# Altium schematic sheet Data_Transmission_Panel.SchDoc
size A3
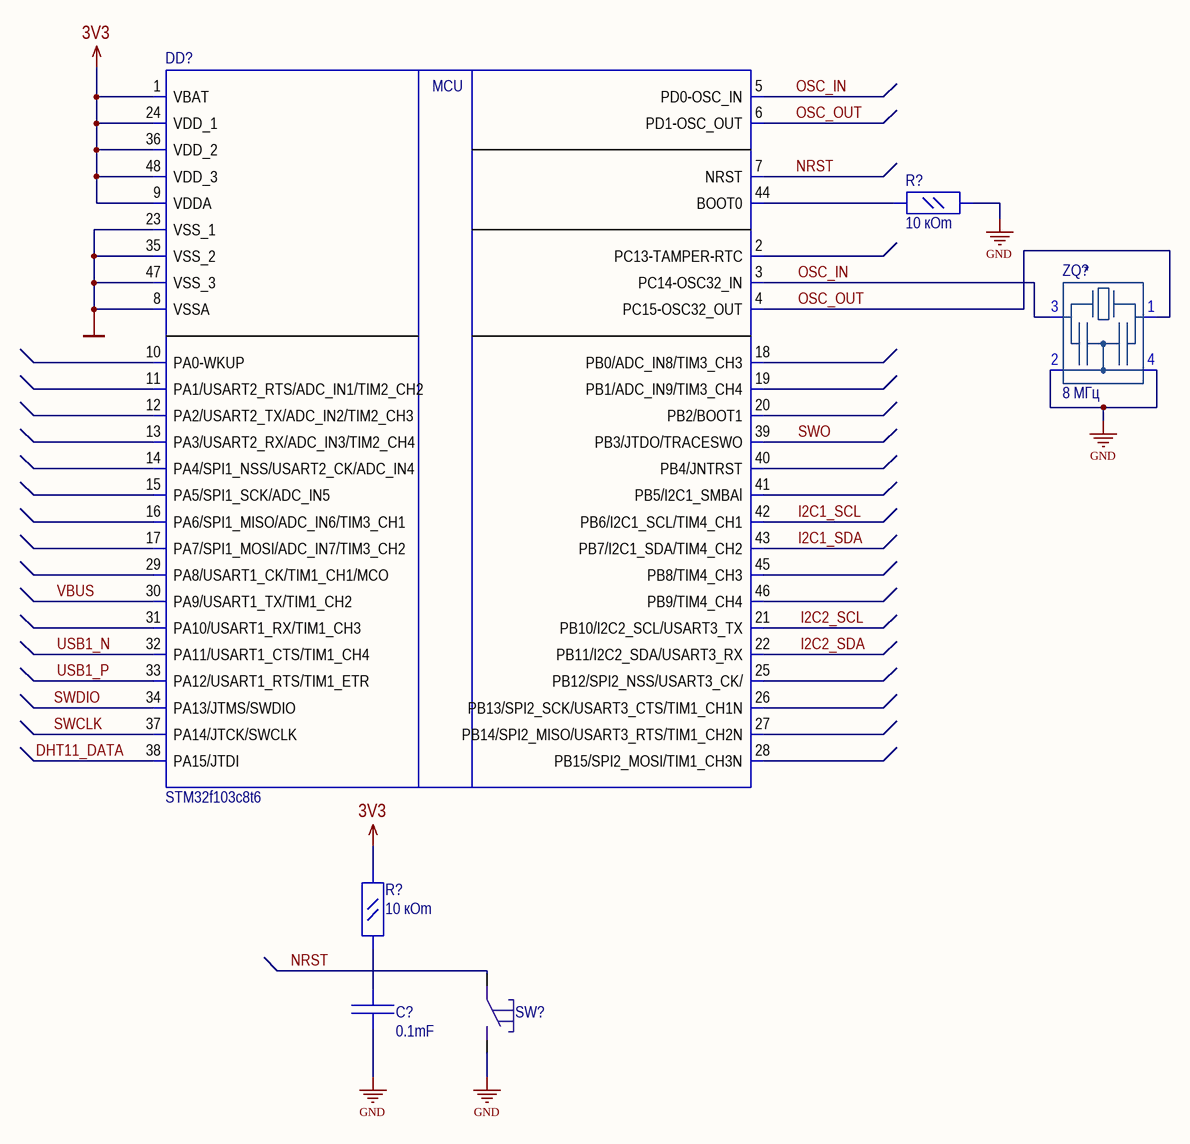
[diagram p0: Data_Transmission_Panel.SchDoc]

## Parts
(Parts that share a designator on the sheet are numbered #1, #2 ... from top to bottom, then left to right.)
C?  0.1mF  [C_0805]
DD?  STM32f103c8t6  [LQFP48]
R?#1  10 кOm  [R_0805]
R?#2  10 кOm  [R_0805]
SW?  KLS7-TS6604  [KLS7-TS6604-5.0-180-B]  (value not drawn)
ZQ?  8 МГц  [MJ CRYSTAL]

## Nets
3V3: DD?.1(VBAT) DD?.9(VDDA) DD?.24(VDD_1) DD?.36(VDD_2) DD?.48(VDD_3) R?#2.2
GND: C?.1 DD?.8(VSSA) DD?.23(VSS_1) DD?.35(VSS_2) DD?.47(VSS_3) R?#1.1 SW?.1 ZQ?.2 ZQ?.4
DHT11_DATA: DD?.38(PA15/JTDI)
I2C1_SCL: DD?.42(PB6/I2C1_SCL/TIM4_CH1)
I2C1_SDA: DD?.43(PB7/I2C1_SDA/TIM4_CH2)
I2C2_SCL: DD?.21(PB10/I2C2_SCL/USART3_TX)
I2C2_SDA: DD?.22(PB11/I2C2_SDA/USART3_RX)
NRST: DD?.7(NRST) SW?.2
OSC_IN: DD?.3(PC14-OSC32_IN) DD?.5(PD0-OSC_IN) ZQ?.3
OSC_OUT: DD?.4(PC15-OSC32_OUT) DD?.6(PD1-OSC_OUT) ZQ?.1
SWCLK: DD?.37(PA14/JTCK/SWCLK)
SWDIO: DD?.34(PA13/JTMS/SWDIO)
SWO: DD?.39(PB3/JTDO/TRACESWO)
USB1_N: DD?.32(PA11/USART1_CTS/TIM1_CH4)
USB1_P: DD?.33(PA12/USART1_RTS/TIM1_ETR)
VBUS: DD?.30(PA9/USART1_TX/TIM1_CH2)
NetC?_2: C?.2 R?#2.1
NetDD?_44: DD?.44(BOOT0) R?#1.2

Not connected (* = marked no-connect by the designer): DD? 2(PC13-TAMPER-RTC) 10(PA0-WKUP) 11(PA1/USART2_RTS/ADC_IN1/TIM2_CH2) 12(PA2/USART2_TX/ADC_IN2/TIM2_CH3) 13(PA3/USART2_RX/ADC_IN3/TIM2_CH4) 14(PA4/SPI1_NSS/USART2_CK/ADC_IN4) 15(PA5/SPI1_SCK/ADC_IN5) 16(PA6/SPI1_MISO/ADC_IN6/TIM3_CH1) 17(PA7/SPI1_MOSI/ADC_IN7/TIM3_CH2) 18(PB0/ADC_IN8/TIM3_CH3) 19(PB1/ADC_IN9/TIM3_CH4) 20(PB2/BOOT1) 25(PB12/SPI2_NSS/USART3_CK/) 26(PB13/SPI2_SCK/USART3_CTS/TIM1_CH1N) 27(PB14/SPI2_MISO/USART3_RTS/TIM1_CH2N) 28(PB15/SPI2_MOSI/TIM1_CH3N) 29(PA8/USART1_CK/TIM1_CH1/MCO) 31(PA10/USART1_RX/TIM1_CH3) 40(PB4/JNTRST) 41(PB5/I2C1_SMBAl) 45(PB8/TIM4_CH3) 46(PB9/TIM4_CH4)

## Notes on the sheet
- (near ZQ?) *
- Title
- Size:
- Date:
- A3
- Number:
- Time:
- Revision:
- Sheet
- of
- File:
- (in symbol STM32f103c8t6) MCU

## Library data of the parts
C? = C_0805: Value: 0.1mF
R?#1 R?#2 = R_0805: Value: 10 kOm
ZQ? = NX5032GA-8MHz